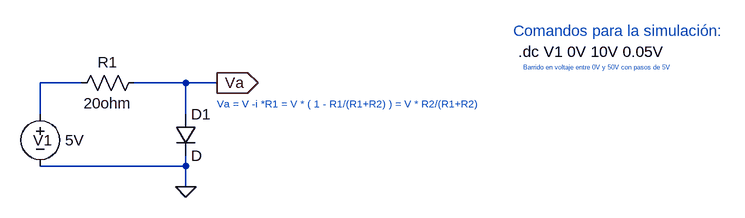
[diagram p0: schematic Diodo_Barrido_En_Voltage.asc]
Diodo_Barrido_En_Voltage.asc, the LTspice schematic file:
Version 4
SHEET 1 1464 680
WIRE 48 64 -16 64
WIRE 208 64 128 64
WIRE 256 64 208 64
WIRE -16 112 -16 64
WIRE 208 112 208 64
WIRE 208 192 208 176
WIRE 208 192 -16 192
WIRE 208 224 208 192
FLAG 208 224 0
FLAG 256 64 Va
IOPIN 256 64 Out
SYMBOL voltage -16 96 R0
WINDOW 0 -11 56 Left 2
WINDOW 3 38 56 Left 2
WINDOW 123 0 0 Left 0
WINDOW 39 -11 112 Left 2
SYMATTR InstName V1
SYMATTR Value 5V
SYMBOL res 32 80 R270
WINDOW 0 32 56 VTop 2
WINDOW 3 0 56 VBottom 2
SYMATTR InstName R1
SYMATTR Value 20ohm
SYMBOL diode 192 112 R0
SYMATTR InstName D1
TEXT 256 96 Left 1 ;Va = V -i *R1 = V * ( 1 - R1/(R1+R2) ) = V * R2/(R1+R2)
TEXT 712 -16 Left 2 ;Comandos para la simulación:
TEXT 720 16 Left 2 !.dc V1 0V 10V 0.05V
TEXT 728 40 Left 0 ;Barrido en voltaje entre 0V y 50V con pasos de 5V

The netlist it stands for:
* Diodo_Barrido_En_Voltage.asc
V1 N001 0 5V
R1 N001 Va 20ohm
D1 Va 0 D
.model D D
.lib standard.dio
* Va = V -i *R1 = V * ( 1 - R1/(R1+R2) ) = V * R2/(R1+R2)
* Comandos para la simulación:
.dc V1 0V 10V 0.05V
* Barrido en voltaje entre 0V y 50V con pasos de 5V
.backanno
.end